# Altium project pi_powerhat.PrjPcb
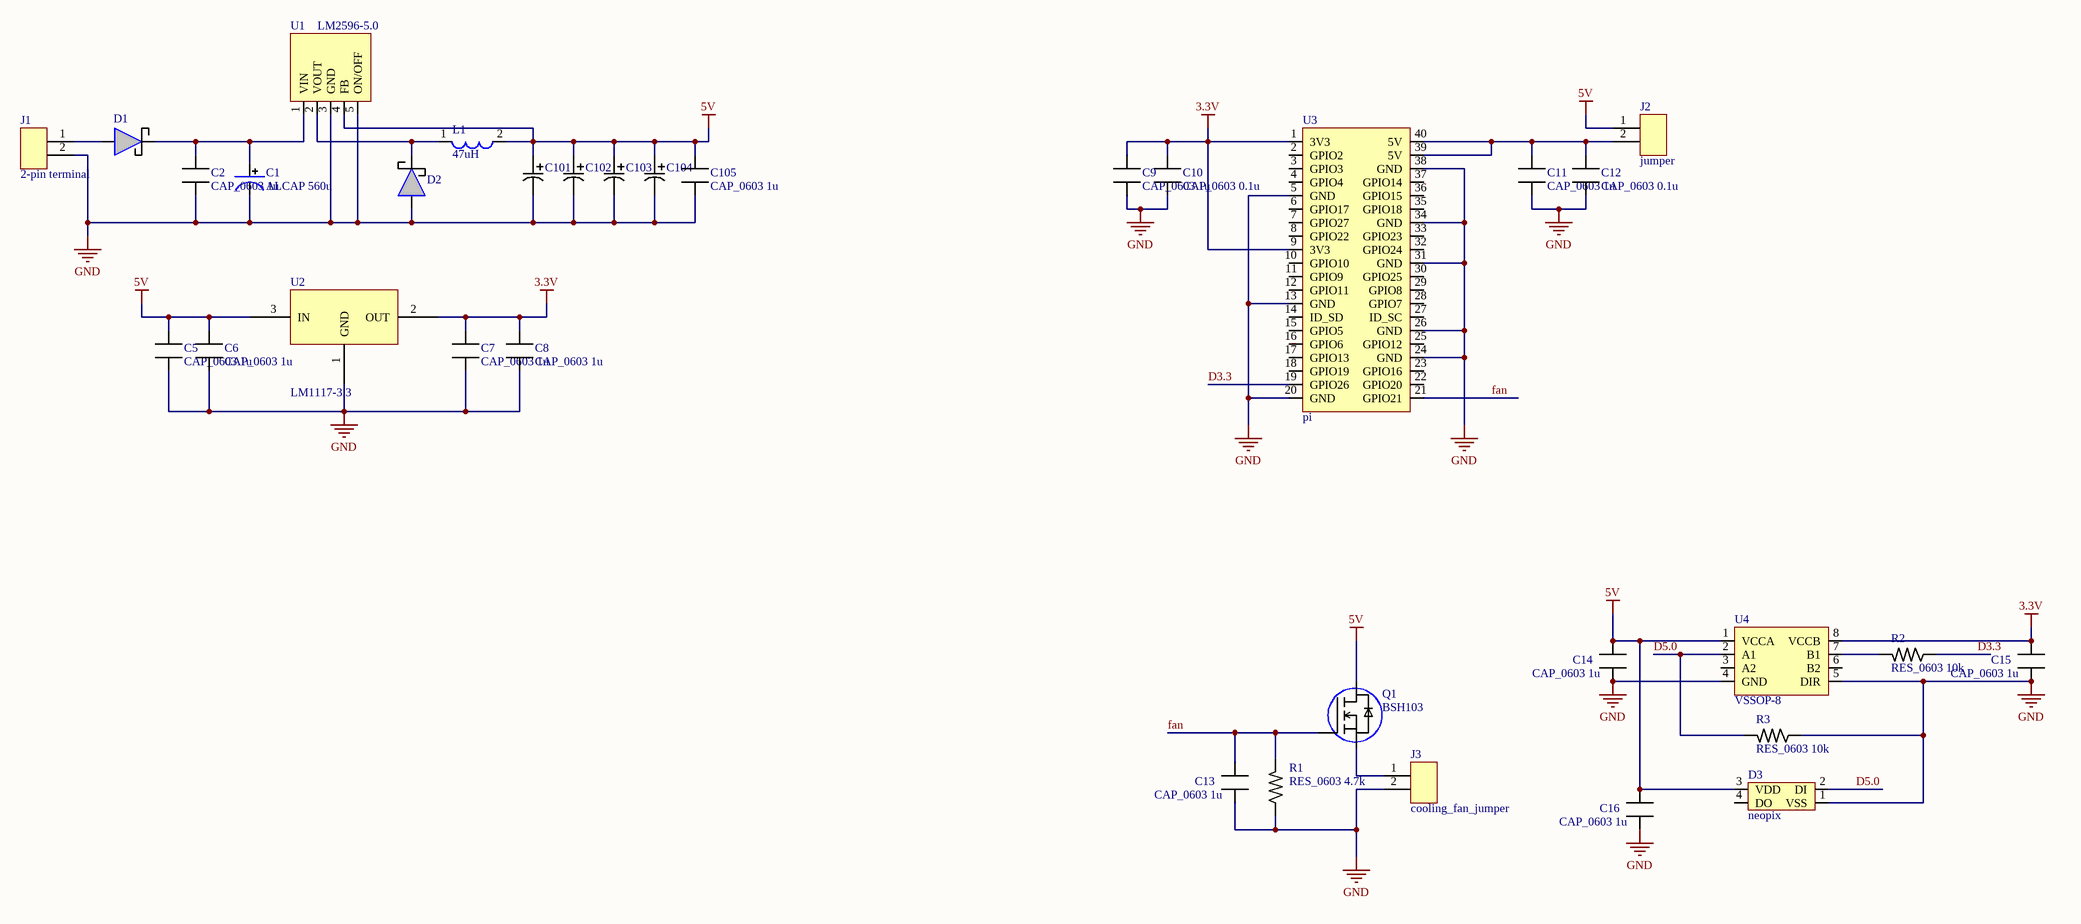
[diagram p0: Sheet1.SchDoc]
1 sheet, 34 parts. Net scope: global (net labels, ports and power ports of the same name join across sheets).
Board file: PCB1.PcbDoc

## Sheet Sheet1.SchDoc
size A2

### Parts
C1  ALCAP 560u  [alcap-560uF]
C2  CAP_0603 1u  [CAP_0603]
C5  CAP_0603 1u  [CAP_0603]
C6  CAP_0603 1u  [CAP_0603]
C7  CAP_0603 1u  [CAP_0603]
C8  CAP_0603 1u  [CAP_0603]
C9  CAP_0603 1u  [CAP_0603]
C10  CAP_0603 0.1u  [CAP_0603]
C11  CAP_0603 1u  [CAP_0603]
C12  CAP_0603 0.1u  [CAP_0603]
C13  CAP_0603 1u  [CAP_0603]
C14  CAP_0603 1u  [CAP_0603]
C15  CAP_0603 1u  [CAP_0603]
C16  CAP_0603 1u  [CAP_0603]
C101  Part Number: TAJC107K010RNJ  [TAJC]  (value not drawn)
C102  Part Number: TAJC107K010RNJ  [TAJC]  (value not drawn)
C103  Part Number: TAJC107K010RNJ  [TAJC]  (value not drawn)
C104  Part Number: TAJC107K010RNJ  [TAJC]  (value not drawn)
C105  CAP_0603 1u  [CAP_0603]
D1  RBR3LAM60BTF_diode  [RBR3LAM60BTF_diode]  (value not drawn)
D2  RBR3LAM60BTF_diode  [RBR3LAM60BTF_diode]  (value not drawn)
D3  neopix  [neopix]
J1  2-pin terminal  [2-pin terminal]
J2  jumper  [2pin_jumper]
J3  cooling_fan_jumper  [2pin_jumper]
L1  47uH  [732-11450-1-ND]
Q1  BSH103  [bsh103_MOS]
R1  RES_0603 4.7k  [RES_0603]
R2  RES_0603 10k  [RES_0603]
R3  RES_0603 10k  [RES_0603]
U1  LM2596-5.0  [lm2956-5.0]
U2  LM1117-3.3  [LM1117-3.3]
U3  pi  [pi]
U4  VSSOP-8  [TSOP65P400X130-8M]

### Nets
3.3V: C7.2 C8.2 C9.2 C10.2 C15.2 U2.2(OUT) U3.1(3V3) U3.9(3V3) U4.8(VCCB)
5V: C5.2 C6.2 C14.2 C16.2 C101.1 C102.1 C103.1 C104.1 C105.2 D3.3(VDD) J2.1 L1.2 Q1.2(D) U1.4(FB) U2.3(IN) U4.1(VCCA)
GND: C1.2 C2.1 C5.1 C6.1 C7.1 C8.1 C9.1 C10.1 C11.1 C12.1 C13.1 C14.1 C15.1 C16.1 C101.2 C102.2 C103.2 C104.2 C105.1 D2.2 D3.1(VSS) J1.2 J3.2 R1.1 R3.1 U1.3(GND) U1.5(ON/OFF) U2.1(GND) U3.5(GND) U3.13(GND) U3.20(GND) U3.24(GND) U3.26(GND) U3.31(GND) U3.34(GND) U3.38(GND) U4.4(GND) U4.5(DIR)
D3.3: R2.1 U3.19(GPIO26)
D5.0: D3.2(DI) R3.2 U4.2(A1)
fan: C13.2 Q1.1(G) R1.2 U3.21(GPIO21)
NetC1_1: C1.1 C2.2 D1.1 U1.1(VIN)
NetC11_2: C11.2 C12.2 J2.2 U3.39(5V) U3.40(5V)
NetD1_2: D1.2 J1.1
NetD2_1: D2.1 L1.1 U1.2(VOUT)
NetJ3_1: J3.1 Q1.3(S)
NetR2_2: R2.2 U4.7(B1)

Not connected (* = marked no-connect by the designer): D3 4(DO); U3 2(GPIO2) 3(GPIO3) 4(GPIO4) 6(GPIO17) 7(GPIO27) 8(GPIO22) 10(GPIO10) 11(GPIO9) 12(GPIO11) 14(ID_SD) 15(GPIO5) 16(GPIO6) 17(GPIO13) 18(GPIO19) 22(GPIO20) 23(GPIO16) 25(GPIO12) 27(ID_SC) 28(GPIO7) 29(GPIO8) 30(GPIO25) 32(GPIO24) 33(GPIO23) 35(GPIO18) 36(GPIO15) 37(GPIO14); U4 3(A2) 6(B2)

### Library data of the parts
C1 = ALCAP_47UF: ALCAP; ComponentLink1Description: EEUFR1J470; ComponentLink1URL: https://www.digikey.com/product-detail/en/panasonic-electronic-components/EEU-FR1J470/P15400-ND/3072280
C2 C5-C16 C105 = CAP_0603: ComponentLink1Description: C0603C105K4RACTU; ComponentLink1URL: https://www.digikey.com/product-detail/en/kemet/C0603C105K4RACTU/399-7847-1-ND/3471570
C101-C104 = TAJC107K010RNJ: No Description Available; Vendor: AVX Corporation; Built_By: EMA_UL_Team; Type: DEV; Manufacturer_Part_Number: TAJC107K010RNJ; Copyright: Copyright (C) 2018 Accelerated Designs. All rights reserved; RefDes: RefDes; Value: Value
J2 J3 = 2pin_jumper
  J2: ComponentLink1Description: WM23944-ND; ComponentLink1URL: https://www.digikey.com/product-detail/en/molex/0015381026/WM23944-ND/315124
  J3: ComponentLink1Description: 563-1111-ND; ComponentLink1URL: https://www.digikey.com/product-detail/en/nidec-copal-electronics/F251R-05LLC/563-1111-ND/1165505
L1 = 732-11450-1-ND: ComponentLink1Description: 732-11450-1-ND; ComponentLink1URL: https://www.digikey.com/product-detail/en/w-rth-elektronik/744373965470/732-11450-1-ND/7323676
Q1 = MOSFET_N_1
R1-R3 = RES_0603: RES_0603 1/8 W
U4 = SN74LVC2T45
D1 D2 = RBR3LAM60BTF_diode: ComponentLink1Description: RBR3LAM60BTF; ComponentLink1URL: https://www.digikey.com/product-detail/en/rohm-semiconductor/RBR3LAM60BTFTR/RBR3LAM60BTFCT-ND/8702638